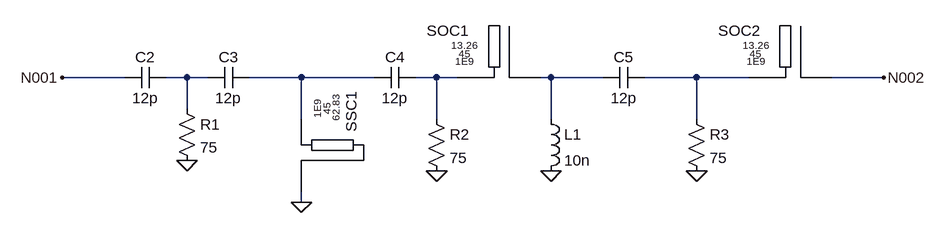
[diagram p0: schematic CircuitoComplejoStubs.asc]
CircuitoComplejoStubs.asc, the LTspice schematic file:
Version 4
SHEET 1 1232 680
WIRE -16 128 -112 128
WIRE 80 128 48 128
WIRE 112 128 80 128
WIRE 256 128 176 128
WIRE 368 128 256 128
WIRE 464 128 432 128
WIRE 496 128 464 128
WIRE 640 128 624 128
WIRE 720 128 640 128
WIRE 864 128 784 128
WIRE 944 128 864 128
WIRE 1152 128 1072 128
WIRE 80 176 80 128
WIRE 256 192 256 128
WIRE 464 192 464 128
WIRE 640 192 640 128
WIRE 864 192 864 128
WIRE 256 320 256 304
FLAG 80 256 0
FLAG 464 272 0
FLAG 640 272 0
FLAG 864 272 0
FLAG -112 128 N001
FLAG 1152 128 N002
FLAG 256 320 0
SYMBOL cap 48 112 R90
WINDOW 0 0 32 VBottom 2
WINDOW 3 32 32 VTop 2
SYMATTR InstName C2
SYMATTR Value 12p
SYMBOL cap 176 112 R90
WINDOW 0 0 32 VBottom 2
WINDOW 3 32 32 VTop 2
SYMATTR InstName C3
SYMATTR Value 12p
SYMBOL cap 432 112 R90
WINDOW 0 0 32 VBottom 2
WINDOW 3 32 32 VTop 2
SYMATTR InstName C4
SYMATTR Value 12p
SYMBOL cap 784 112 R90
WINDOW 0 0 32 VBottom 2
WINDOW 3 32 32 VTop 2
SYMATTR InstName C5
SYMATTR Value 12p
SYMBOL res 64 160 R0
SYMATTR InstName R1
SYMATTR Value 75
SYMBOL res 448 176 R0
SYMATTR InstName R2
SYMATTR Value 75
SYMBOL res 848 176 R0
SYMATTR InstName R3
SYMATTR Value 75
SYMBOL ind 624 176 R0
SYMATTR InstName L1
SYMATTR Value 10n
SYMBOL SSC 304 256 R90
SYMATTR SpiceModel 62.83
SYMATTR Value 45
SYMATTR Value2 1E9
SYMATTR InstName SSC1
SYMBOL SOC 592 96 R0
SYMATTR SpiceModel 13.26
SYMATTR Value 45
SYMATTR Value2 1E9
SYMATTR InstName SOC1
SYMBOL SOC 1040 96 R0
SYMATTR SpiceModel 13.26
SYMATTR Value 45
SYMATTR Value2 1E9
SYMATTR InstName SOC2

The netlist it stands for:
* CircuitoComplejoStubs.asc
C2 N003 N001 12p
C3 N004 N003 12p
C4 N005 N004 12p
C5 N007 N006 12p
R1 N003 0 75
R2 N005 0 75
R3 N007 0 75
L1 N006 0 10n
SSC1 N004 0 62.83 45 1E9
SOC1 N005 N006 13.26 45 1E9
SOC2 N007 N002 13.26 45 1E9
.backanno
.end